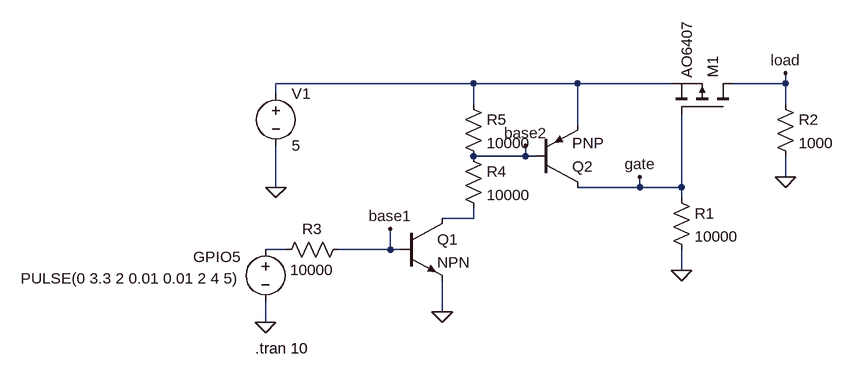
[diagram p0: schematic transistortest.asc]
transistortest.asc, the LTspice schematic file:
Version 4
SHEET 1 880 680
WIRE 64 -48 -240 -48
WIRE 224 -48 64 -48
WIRE 368 -48 224 -48
WIRE 544 -48 544 -64
WIRE 544 -48 464 -48
WIRE -240 -32 -240 -48
WIRE 64 -16 64 -48
WIRE 544 -16 544 -48
WIRE 224 16 224 -48
WIRE 144 64 144 48
WIRE 144 64 64 64
WIRE 160 64 144 64
WIRE 544 96 544 64
WIRE -240 112 -240 48
WIRE 320 112 320 96
WIRE 320 112 224 112
WIRE 384 112 384 0
WIRE 384 112 320 112
WIRE 384 128 384 112
WIRE 64 160 64 144
WIRE 64 160 16 160
WIRE -224 208 -256 208
WIRE -64 208 -64 176
WIRE -64 208 -144 208
WIRE -48 208 -64 208
WIRE 384 240 384 208
WIRE 16 304 16 256
WIRE -256 320 -256 288
FLAG -240 112 0
FLAG -256 320 0
FLAG 384 240 0
FLAG 544 96 0
FLAG -64 176 base1
FLAG 544 -64 load
FLAG 320 96 gate
FLAG 16 304 0
FLAG 144 48 base2
SYMBOL res 368 112 R0
SYMATTR InstName R1
SYMATTR Value 10000
SYMBOL voltage -240 -48 R0
WINDOW 123 0 0 Left 0
WINDOW 39 0 0 Left 0
SYMATTR InstName V1
SYMATTR Value 5
SYMBOL voltage -256 192 R0
WINDOW 123 0 0 Left 0
WINDOW 39 0 0 Left 0
WINDOW 0 -111 27 Left 2
WINDOW 3 -39 60 Right 2
SYMATTR InstName GPIO5
SYMATTR Value PULSE(0 3.3 2 0.01 0.01 2 4 5)
SYMBOL pmos 464 0 M270
SYMATTR InstName M1
SYMATTR Value AO6407
SYMBOL res 528 -32 R0
SYMATTR InstName R2
SYMATTR Value 1000
SYMBOL res -128 192 R90
WINDOW 0 0 56 VBottom 2
WINDOW 3 32 56 VTop 2
SYMATTR InstName R3
SYMATTR Value 10000
SYMBOL npn -48 160 R0
SYMATTR InstName Q1
SYMBOL pnp 160 112 M180
SYMATTR InstName Q2
SYMBOL res 48 48 R0
SYMATTR InstName R4
SYMATTR Value 10000
SYMBOL res 48 -32 R0
SYMATTR InstName R5
SYMATTR Value 10000
TEXT -272 360 Left 2 !.tran 10

The netlist it stands for:
* transistortest.asc
R1 gate 0 10000
V1 N001 0 5
V§GPIO5 N003 0 PULSE(0 3.3 2 0.01 0.01 2 4 5)
M1 load gate N001 N001 AO6407
R2 load 0 1000
R3 base1 N003 10000
Q1 N002 base1 0 0 NPN
Q2 gate base2 N001 0 PNP
R4 base2 N002 10000
R5 N001 base2 10000
.model NPN NPN
.model PNP PNP
.lib standard.bjt
.model NMOS NMOS
.model PMOS PMOS
.lib standard.mos
.tran 10
.backanno
.end